# Altium schematic sheet ARDUINO_UNO_CH340.SchDoc
size 431 x 279 mm; SheetNumber: 1; SheetTotal: 1
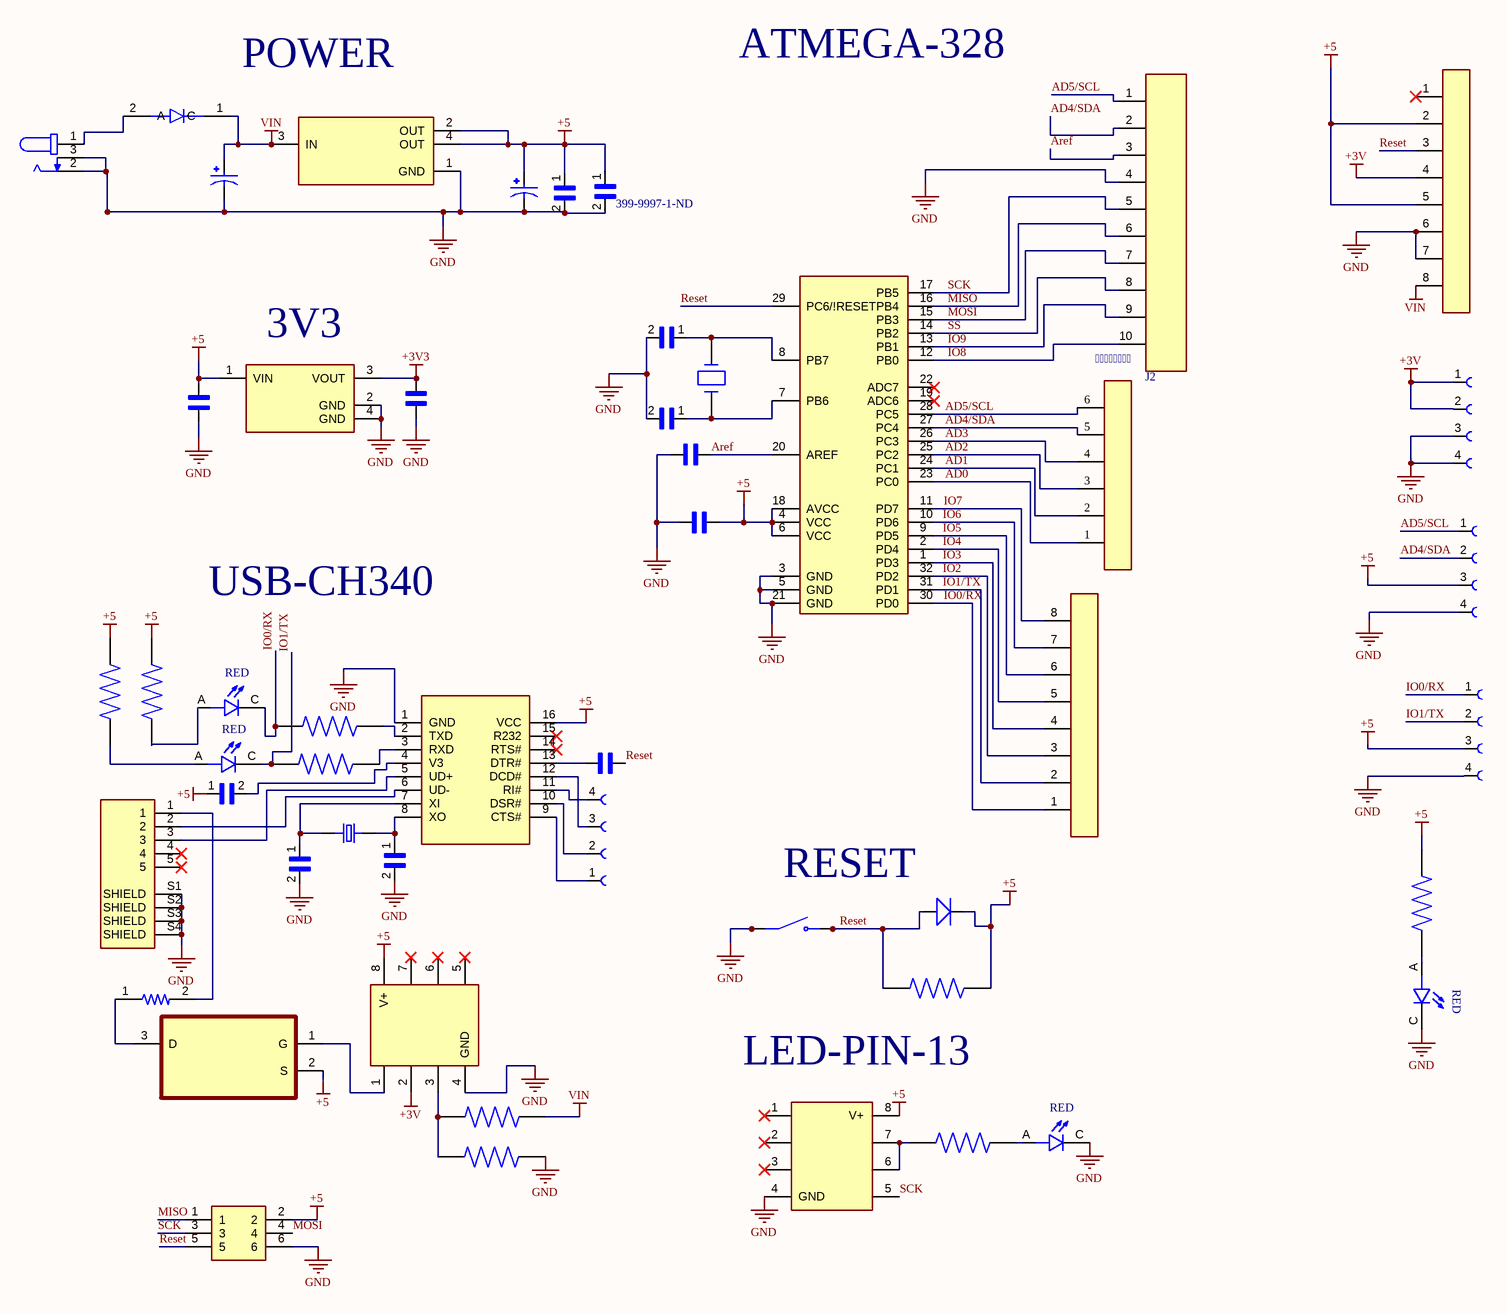
[diagram p0: ARDUINO_UNO_CH340.SchDoc]

## Parts
C1  CAP ALUM 47UF 20% 25V SMD  [CAP_25SVPD47M]  (value not drawn)
C2  CAP ALUM 47UF 20% 25V SMD  [CAP_25SVPD47M]  (value not drawn)
C3  C0805J104K5RACTU  [CAPC2012X88N]  (value not drawn)
C4  Supplier Part Number 1: 399-9997-1-ND  [CAPC2012X88N]  (hidden comment: C0805J104K5RACTU)
C5  CAP CER 25PF 100V NP0 0805  [CAPC2012X94N]  (value not drawn)
C6  CAP CER 25PF 100V NP0 0805  [CAPC2012X94N]  (value not drawn)
C7  885012209041  [WCAP-CSGP_885012209041]  (value not drawn)
C8  885012209041  [WCAP-CSGP_885012209041]  (value not drawn)
C9  885012209041  [WCAP-CSGP_885012209041]  (value not drawn)
C10  885012209041  [WCAP-CSGP_885012209041]  (value not drawn)
C11  CAP CER 0805 10NF 50V C0G 1%  [CAPC2012X88N]  (value not drawn)
C12  885012209041  [WCAP-CSGP_885012209041]  (value not drawn)
C13  CAP CER 25PF 100V NP0 0805  [CAPC2012X94N]  (value not drawn)
C14  CAP CER 25PF 100V NP0 0805  [CAPC2012X94N]  (value not drawn)
CO1  CRYSTAL 16.0000MHZ 18PF SMD  [XTAL_ABLS2-24.000MHZ-D4YF-T]  (value not drawn)
CP1  CONN PWR JACK 2X5.5MM SOLDER  [POWERJACK_CUI_PJ-002A]  (value not drawn)
D1  S1M-FDITR-ND  [DIODE_DIOM4226X244N]  (value not drawn)
D2  7012X1  [LED_7012X1]  (value not drawn)
D3  7012X1  [LED_7012X1]  (value not drawn)
D4  DIODE GEN PURP 100V 150MA 1206  [DIODE]  (value not drawn)
D5  7012X1  [LED_7012X1]  (value not drawn)
D6  7012X1  [LED_7012X1]  (value not drawn)
J1  Conn_Sullins_PPTC081LFBN-RC_eec  [Sullins_PPTC081LFBN-RC_0]  (value not drawn)
J2  Conn_Sullins_PPTC101LFBN-RC_eec  [Sullins_PPTC101LFBN-RC_0 - duplicate2]  (value not drawn)
J3  PPTC061LFBN-RC  [Sullins_PPTC061LFBN-RC_0]  (value not drawn)
J4  Conn_Sullins_PPTC081LFBN-RC_eec  [Sullins_PPTC081LFBN-RC_0]  (value not drawn)
J5  1734035-4  [J_SMD_1734035-4-5_0.8_9.9_8.85_3.9]  (value not drawn)
J6  67997-206HLF  [FRAMATOME_67997-206HLF]  (value not drawn)
K1  61300411121  [61300411121]  (value not drawn)
K2  61300411121  [61300411121]  (value not drawn)
K3  61300411121  [61300411121]  (value not drawn)
K4  61300411121  [61300411121]  (value not drawn)
MC1  ATMEGA328P-AU  [QFP80P900X900X120-32N]  (value not drawn)
R1  1kOhm,0805,1%,50ppm, 100mW,100VRN732ATTDK1001F50  [RESC2012X60N]  (value not drawn)
R2  1kOhm,0805,1%,50ppm, 100mW,100VRN732ATTDK1001F50  [RESC2012X60N]  (value not drawn)
R3  1kOhm,0805,1%,50ppm, 100mW,100VRN732ATTDK1001F50  [RESC2012X60N]  (value not drawn)
R4  1kOhm,0805,1%,50ppm, 100mW,100VRN732ATTDK1001F50  [RESC2012X60N]  (value not drawn)
R5  1kOhm,0805,1%,50ppm, 100mW,100VRN732ATTDK1001F50  [RESC2012X60N]  (value not drawn)
R6  1kOhm,0805,1%,50ppm, 100mW,100VRN732ATTDK1001F50  [RESC2012X60N]  (value not drawn)
R7  PICOSMDC050S-2  [RESC2012X60N]  (value not drawn)
R8  CRGCQ0805F10K  [RESC2012X65N]  (value not drawn)
R9  CRGCQ0805F10K  [RESC2012X65N]  (value not drawn)
R10  1kOhm,0805,1%,50ppm, 100mW,100VRN732ATTDK1001F50  [RESC2012X60N]  (value not drawn)
S1  2-1437565-8  [SW_2-1437565-8]  (value not drawn)
U1  NCP1117ST50T3G  [SOT230P700X180-4N]  (value not drawn)
U2  MCP1703T-3302E/DB  [SOT230P700X180-4N - duplicate]  (value not drawn)
U3  CH340 USB 2.0 to UART Interface Evaluation Board  [SO16]  (value not drawn)
U4  LM358M/NOPB  [SOIC127P599X175-8N]  (value not drawn)
U5  SI2301BDS-T1-E3  [SOT95P237X112-3N]  (value not drawn)
U6  LM358M/NOPB  [SOIC127P599X175-8N]  (value not drawn)
Y1  ECS-120-S-5PX-TR  [XTAL_ECS-120-S-5PX-TR]  (value not drawn)

## Nets
+3V: J1.4 K1.1 K1.2 U4.2(-INA)
+3V3: C7.2 U2.3(VOUT)
+5: C2.1 C3.1 C4.1 C8.2 C10.1 C11.1 D4.NEG J1.2 J1.5 J6.2 K2.3 K3.3 MC1.4(VCC) MC1.6(VCC) MC1.18(AVCC) R1.2 R2.1 R5.1 R6.2 U1.2(OUT) U1.4(OUT) U2.1(VIN) U3.16(VCC) U4.8(V+) U5.2(S) U6.8(V+)
GND: C1.2 C2.2 C3.2 C4.2 C5.2 C6.2 C7.1 C8.1 C9.1 C10.2 C13.2 C14.2 CP1.2 CP1.3 D5.C D6.C J1.6 J1.7 J2.4 J5.S1(SHIELD) J5.S2(SHIELD) J5.S3(SHIELD) J5.S4(SHIELD) J6.6 K1.3 K1.4 K2.4 K3.4 MC1.3(GND) MC1.5(GND) MC1.21(GND) R9.2 S1.1(COM) S1.2(COM) U1.1(GND) U2.2(GND) U2.4(GND) U3.1(GND) U4.4(GND) U6.4(GND)
VIN: C1.1 D1.1(C) J1.8 R8.2 U1.3(IN)
AD0: J3.1 MC1.23(PC0)
AD1: J3.2 MC1.24(PC1)
AD2: J3.3 MC1.25(PC2)
AD3: J3.4 MC1.26(PC3)
AD4/SDA: J2.2 J3.5 K2.2 MC1.27(PC4)
AD5/SCL: J2.1 J3.6 K2.1 MC1.28(PC5)
Aref: C9.2 J2.3 MC1.20(AREF)
IO0/RX: D2.C J4.1 K3.1 MC1.30(PD0) R3.1
IO1/TX: D3.C J4.2 K3.2 MC1.31(PD1) R4.1
IO2: J4.3 MC1.32(PD2)
IO3: J4.4 MC1.1(PD3)
IO4: J4.5 MC1.2(PD4)
IO5: J4.6 MC1.9(PD5)
IO6: J4.7 MC1.10(PD6)
IO7: J4.8 MC1.11(PD7)
IO8: J2.10 MC1.12(PB0)
IO9: J2.9 MC1.13(PB1)
MISO: J2.6 J6.1 MC1.16(PB4)
MOSI: J2.7 J6.4 MC1.15(PB3)
Reset: C12.1 D4.POS J1.3 J6.5 MC1.29(PC6/!RESET) R6.1 S1.3(NO) S1.4(NO)
SCK: J2.5 J6.3 MC1.17(PB5) U6.5(+INB)
SS: J2.8 MC1.14(PB2)
NetC5_1: C5.1 CO1.1 MC1.8(PB7)
NetC6_1: C6.1 CO1.2 MC1.7(PB6)
NetC11_2: C11.2 U3.4(V3)
NetC12_2: C12.2 U3.13(DTR#)
NetC13_1: C13.1 U3.8(XO) Y1.2
NetC14_1: C14.1 U3.7(XI) Y1.1
NetCP1_1: CP1.1 D1.2(A)
NetD2_A: D2.A R2.2
NetD3_A: D3.A R1.1
NetD5_A: D5.A R5.2
NetD6_A: D6.A R10.2
NetJ5_1: J5.1 R7.2
NetJ5_2: J5.2 U3.6(UD-)
NetJ5_3: J5.3 U3.5(UD+)
NetK4_1: K4.1 U3.9(CTS#)
NetK4_2: K4.2 U3.10(DSR#)
NetK4_3: K4.3 U3.12(DCD#)
NetK4_4: K4.4 U3.11(RI#)
NetR3_2: R3.2 U3.2(TXD)
NetR4_2: R4.2 U3.3(RXD)
NetR7_1: R7.1 U5.3(D)
NetR8_1: R8.1 R9.1 U4.3(+INA)
NetR10_1: R10.1 U6.6(-INB) U6.7(OUTB)
NetU4_1: U4.1(OUTA) U5.1(G)

Not connected (* = marked no-connect by the designer): J1 1*; J5 4* 5*; MC1 19(ADC6)* 22(ADC7)*; U3 14(RTS#)* 15(R232)*; U4 5(+INB)* 6(-INB)* 7(OUTB)*; U6 1(OUTA)* 2(-INA)* 3(+INA)*

## Notes on the sheet
- POWER
- ATMEGA-328
- (near U2) 3V3
- USB-CH340
- RESET
- LED-PIN-13
- DWG. NO.
- REV.
- SHT.
- THIS DOCUMENT AND THE DATA DISCLOSED HEREIN OR HEREWITH IS THE PROPERTY OF ALTIUM LIMITED AND MAY BE FREELY DISTRIBUTED IN WHOLE. NO RIGHTS ARE RESERVED OR EXPRESS OR IMPLIED WARANTEE GIVEN.
- REVISION
- DESCRIPTION
- DATE
- APPROVED
- ENG:
- APPROVALS
- PROJECT
- DSN:
- CHK:
- REFERENCE DOCUMENTS
- PROJECT REVISION:
- TITLE
- DOCUMENT REVISION:
- DESIGN ITEM:
- BOM:
- FAB DWG:
- PCB DWG:
- ASSY DWG:
- SCALE:
- SIZE
- B
- CAGE CODE
- FILE NAME
- DWG NO.
- SHEET
- OF
- REV
- (in symbol 7012X1) RED
- (in symbol LM358M/NOPB) B; A

## Library data of the parts
C1 C2 = 25SVPD47M: 47 µF 25 V Aluminum Electrolytic Capacitors Radial, Can - SMD - 3000 Hrs @ 105°C; Package: None; Availability: Unavailable; Value: *; MP: 25SVPD47M; Price: None; Supplier 1: Newark; Supplier Part Number 1: 31T8177
C3 C4 = C0805J104K5RACTU: CAP MLCC, 0.1UF, 50V, X7R, 10%, 0805; Product Range: KEMET - J Series; Capacitance; SnapEDA_Link: https://www.snapeda.com/parts/C0805J104K5RACTU/KEMET/view-part/1757688/?ref=snap; MF: KEMET; Mouser-Purchase-URL: https://snapeda.com/shop?store=Mouser&id=1757688; Availability: Warning; Value: *; Package: 0805 KEMET; MP: C0805J104K5RACTU; Price: None; Supplier 1: Digi-Key
  C3: Supplier Part Number 1: 399-9997-1-ND
C5 C6 C13 C14 = 08051A250GAT2A: 25 pF ±2% 100V Ceramic Capacitor C0G, NP0 0805 (2012 Metric); Package: None; Price: None; Value: *; MP: 08051A250GAT2A; Availability: Unavailable; Supplier 1: Digi-Key; Supplier Part Number 1: 08051A250GAT2A-ND
C7-C10 C12 = 885012209041: WCAP-CSGP General Purpose MLCC; SMT 1210; X7R; 100nF 10%; 50V; -55C to +125C; Tech. PN X7R1210104K050DFCT1000; Package: None; Price: None; Value: *; MP: 885012209041; Availability: Unavailable
C11 = C0805C103F5GEC-ND: ±1% 50V Ceramic Capacitor C0G, NP0 0805 (2012 Metric); MF: KEMET; MP: C0805J104K5RACTU; SnapEDA_Link: https://www.snapeda.com/parts/C0805J104K5RACTU/KEMET/view-part/1757688/?ref=snap; Mouser-Purchase-URL: https://snapeda.com/shop?store=Mouser&id=1757688; Availability: Warning; Value: *; Package: 0805 KEMET; Price: None; Supplier 1: Digi-Key; Supplier Part Number 1: C0805C103F5GEC-ND
CO1 = ABLS2-24.000MHZ-D4YF-T: 24MHz Â±30ppm Crystal 18pF 40 Ohms HC-49/US; MF: Abracon; Value: *; MP: ABLS2-24.000MHZ-D4YF-T; Availability: Good; SnapEDA_Link: https://www.snapeda.com/parts/ABLS2-24.000MHZ-D4YF-T/Abracon%20LLC/view-part/412221/?ref=snap; Purchase-URL: https://pricing.snapeda.com/search/part/ABLS2-24.000MHZ-D4YF-T/?ref=eda; Price: None; Check_prices: https://www.snapeda.com/parts/ABLS2-24.000MHZ-D4YF-T/Abracon%20LLC/view-part/412221/?ref=eda; Package: HC49/US Abracon; Supplier 1: Digi-Key; Supplier Part Number 1: 535-10212-1-ND
CP1 = CP-002A-ND: Power Barrel Connector Jack 2.10mm ID (0.083"), 5.50mm OD (0.217") Through Hole, Right Angle; Supplier 1: Onlinecomponents.com; Supplier Part Number 1: PJ-002AH-SMT-TR
D1 = DIODE_S1G: DIODE GEN PURP 1KV 1A SMA; MF: ON Semiconductor; MP: ES1G; Package: DO-214AC-214 ON Semiconductor; Value: *; Price: None; Availability: Unavailable; SnapEDA_Link: https://www.snapeda.com/parts/ES1G/ON%20Semiconductor/view-part/1427700/?ref=snap; Supplier 1: Digi-Key; Supplier Part Number 1: S1M-FDICT-ND
D2 D3 D5 D6 = 7012X1: Red LED Indication - Discrete 1.7V 0805 (2012 Metric); Package: None; Price: None; Value: *; MP: 7012X1; Availability: Unavailable; Supplier 1: Digi-Key; Supplier Part Number 1: 732-4984-1-ND
D4 = CD1206-S01575: Diode Standard 100V 150mA Surface Mount 1206; MF: Bourns; Price: None; Availability: Unavailable; Package: 1206 Bourns; MP: CD1206-S01575; Value: *; SnapEDA_Link: https://www.snapeda.com/parts/CD1206-S01575/Bourns%20-%20J.W.%20Miller/view-part/42622/?ref=snap; Supplier 1: Avnet; Supplier Part Number 1: CD1206-S01575
J1 J4 = Conn_Sullins_PPTC081LFBN-RC_eec: CONN HEADER FEMALE 8POS .1" TIN; Is Female: yes; helpURL: https://upverter.com/upn/revision/35dac8b21b21bbc7/; ComponentLink2Description: Datasheet; Temperature: -40°C to +105°C; Package: HDR8; Supplier 2: Mouser; Price: 0.506645376634; Supplier 1: Digi-Key; ComponentLink1URL: https://upverter.com/upn/revision/35dac8b21b21bbc7/; Supplier Part Number 1: S7006-ND; Manufacturer: Sullins; ComponentLink1Description: Upverter; ComponentLink2URL: http://www.sullinscorp.com/drawings/78_P(N)PxCxxxLFBN-RC,_10492-H.pdf; RoHS: TRUE; Temperature Range High: +105°C; Digikey Description: CONN HEADER FEMALE 8POS .1" TIN; Digikey Part Number: S7006-ND; Lead Free: yes; Temperature Range Low: -40°C; Part Number: PPTC081LFBN-RC
J2 = Conn_Sullins_PPTC101LFBN-RC_eec: CONN HEADER FEMALE 10POS.1" TIN; Category Bda670Ac885E6661: Uncategorized; Category E7012A0Bd22E3Cc6: Headers & Receptacles; contact_material: Phosphor Bronze; pin_pitch: 2.54 mm; Is Female: yes; number_of_rows: 1; Category 75Fab8F04590Ae3D: Connectors and Adapters; number_of_positions: 10; Symbol 0 0: Standard; Category 0836C53C3D42D3F1: Connectors; helpURL: https://upverter.com/upn/revision/438243a39a4aeeed/; ComponentLink2Description: Datasheet; Temperature: -40°C to +105°C; Package: HDR10; Supplier 2: Mouser; Price: 0.506714616829; Supplier 1: Digi-Key; ComponentLink1URL: https://upverter.com/upn/revision/438243a39a4aeeed/; Supplier Part Number 1: S7008-ND; Manufacturer: Sullins; ComponentLink1Description: Upverter; ComponentLink2URL: http://www.sullinscorp.com/drawings/78_P(N)PxCxxxLFBN-RC,_10492-H.pdf; RoHS: TRUE; Temperature Range High: +105°C; Octopart Part Number: a3ed6ae3a4397c2a; Digikey Description: CONN HEADER FEMALE 10POS.1" TIN; Digikey Part Number: S7008-ND; Category A3C16Ecb93907806: Uncategorized; Type: integrated circuit; Lead Free: yes; Temperature Range Low: -40°C; Mounting Type: through hole; Num Pins: 10; housing_material: Plastic; Part Number: PPTC101LFBN-RC
J5 = 1734035-4: Conn Mini USB 2.0 Type B RCP 5 POS 0.8mm Solder RA SMD 5 Terminal 1 Port Automotive T/R; MF: TE Connectivity; Centerline_Pitch: .8 mm[.031 in]; Product_Type: Connector; Number_of_Positions: 5; Digi-Key_Purchase_URL: https://www.digikey.com/product-detail/en/te-connectivity-amp-connectors/1734035-4/A121554CT-ND/5246531?utm_source=snapeda&utm_medium=aggregator&utm_campaign=symbol; TE_purchase_URL: https://www.te.com/usa-en/product-1734035-4.html?te_bu=Cor&te_type=disp&te_campaign=seda_glo_cor-seda-global-disp-prtnr-fy19-seda-model-bom-cta_sma-317_1&elqCampaignId=32493; Value: *; Digi-Key_Part_Number: A121554CT-ND; SnapEDA_Link: https://www.snapeda.com/parts/1734035-4/TE%20Connectivity%20AMP%20Connectors/view-part/422958/?ref=snap; EU_RoHS_Compliance: Compliant; MP: 1734035-4; Package: None
J6 = 67997-206HLF: Connector Header Through Hole 6 position 0.100 _2.54mm_; MF: Amphenol ICC; SnapEDA_Link: https://www.snapeda.com/parts/67997-206HLF/Amphenol%20FCI/view-part/103429/?ref=snap; Value: *; Digi-Key_Purchase_URL: https://www.digikey.com/product-detail/en/amphenol-icc-fci/67997-206HLF/609-3234-ND/1878491?utm_source=snapeda&utm_medium=aggregator&utm_campaign=symbol; Digi-Key_Part_Number: 609-3234-ND; MP: 67997-206HLF; Package: None
K1-K4 = 61300411121: Connector Header Through Hole 4 position 0.100 (2.54mm); MF: WÃ¼rth Elektronik; Price: None; Check_prices: https://www.snapeda.com/parts/61300411121/W%C3%BCrth%20Elektronik/view-part/4802916/?ref=eda; SnapEDA_Link: https://www.snapeda.com/parts/61300411121/W%C3%BCrth%20Elektronik/view-part/4802916/?ref=snap; Package: None; Availability: In Stock; MP: 61300411121; Value: *
MC1 = ATMEGA328P-AU: AVR AVRÂ® ATmega Microcontroller IC 8-Bit 20MHz 32KB _16K x 16_ FLASH 32-TQFP _7x7_; MF: Microchip; Value: *; SnapEDA_Link: https://www.snapeda.com/parts/ATMEGA328P-AU/Microchip/view-part/44280/?ref=snap; MP: ATMEGA328P-AU; Availability: Unavailable; Price: None; Package: TQFP-32 Microchip; Supplier 1: RSComponents; Supplier Part Number 1: 1310271
R1-R6 R10 = 1kOhm,0805,1%,50ppm, 100mW,100VRN732ATTDK1001F50: Thin Film Resistors - SMD 1kOhm,0805,1%,50ppm, 100mW,100V; Package: None; Price: None; Value: *; MP: RN732ATTDK1001F50; Availability: Unavailable; Supplier 1: Future Electronics; Supplier Part Number 1: 7028531
R7 = PICOSMDC050S-2: Polymeric PTC Resettable Fuse 6V 500mA Ih Surface Mount 0805 _2012 Metric_, Concave; MF: Littelfuse Inc.; Price: None; SnapEDA_Link: https://www.snapeda.com/parts/PICOSMDC050S-2/Littelfuse%20Inc./view-part/1315044/?ref=snap; MP: PICOSMDC050S-2; Value: *; Availability: Unavailable; Package: 0805 TE Connectivity; Supplier 1: Digi-Key; Supplier Part Number 1: PICOSMDC050S-2CT-ND
R8 R9 = CRGCQ0805F10K: Fixed Resistor CRGCQ 0805 10K 1%; MF: TE Connectivity; MP: CRGCQ0805F10K; DigiKey-Purchase-URL: https://snapeda.com/shop?store=DigiKey&id=3188209; Arrow_Electronics-Purchase-URL: https://snapeda.com/shop?store=Arrow+Electronics&id=3188209; Availability: Unavailable; SnapEDA_Link: https://www.snapeda.com/parts/CRGCQ0805F10K/TE%20Connectivity/view-part/3188209/?ref=snap; Package: 2012 TE Connectivity; Price: None; Value: *; Supplier 1: Digi-Key; Supplier Part Number 1: A129761CT-ND
S1 = 2-1437565-8: Tactile Switch SPST-NO Top Actuated Surface Mount; MF: TE Connectivity; Configuration_Pole-Throw: Single Pole - Single Throw; Contact_Current_Rating: 50 mA; SnapEDA_Link: https://www.snapeda.com/parts/2-1437565-8/TE%20Connectivity%20ALCOSWITCH%20Switches/view-part/455292/?ref=snap; Availability: Unavailable; TE_purchase_URL: https://www.te.com/usa-en/product-2-1437565-8.html?te_bu=Cor&te_type=disp&te_campaign=seda_glo_cor-seda-global-disp-prtnr-fy19-seda-model-bom-cta_sma-317_1&elqCampaignId=32493; Value: *; Price: None; MP: 2-1437565-8; Package: None; Supplier 1: Digi-Key; Supplier Part Number 1: 450-3355-ND
U1 = NCP1117ST50T3G: Linear Voltage Regulator IC 1 Output 1A SOT-223; MF: ON Semiconductor; MP: NCP1117ST50T3G; Package: TO-261-4 ON Semiconductor; Price: None; Value: *; SnapEDA_Link: https://www.snapeda.com/parts/NCP1117ST50T3G/ON%20Semiconductor/view-part/836318/?ref=snap; Availability: Unavailable; Supplier 1: Newark; Supplier Part Number 1: 71J6563
U2 = MCP1703T-3302E/DB: Linear Voltage Regulator IC 1 Output 250mA SOT-223-3; MF: Microchip; MP: MCP1703T-3302E/DB; Availability: Unavailable; SnapEDA_Link: https://www.snapeda.com/parts/MCP1703T-3302E/DB/Microchip/view-part/1037153/?ref=snap; Value: *; Package: SOT-223-3 Microchip; Price: None
U3 = CH340: MF: DFRobot; Value: *; Price: None; Package: None; SnapEDA_Link: https://www.snapeda.com/parts/CH340/DFRobot/view-part/53354/?ref=snap; Availability: Unavailable; MP: CH340; Supplier 1: Onlinecomponents.com; Supplier Part Number 1: 317990026
U4 U6 = LM358M/NOPB: 2-Channel, 1MHz, industry standard, 32V op amp 8-SOIC 0 to 70; MF: Texas Instruments; MP: LM358M; Digi-Key_Part_Number: LM358MX/NOPBTR-ND; SnapEDA_Link: https://www.snapeda.com/parts/LM358M/Texas%20Instruments/view-part/4800527/?ref=snap; Package: SOIC-8 Texas Instruments; DigiKey-Purchase-URL: https://snapeda.com/shop?store=DigiKey&id=4800527; Value: *; Check_prices: https://www.snapeda.com/parts/LM358M/Texas%20Instruments/view-part/4800527/?ref=eda
U5 = SI2301BDS-T1-E3: P-Channel 20V 2.2A _Ta_ 700mW _Ta_ Surface Mount SOT-23-3 _TO-236_; MF: Vishay; Package: SOT-23-3 Vishay; MP: SI2301BDS-T1-E3; SnapEDA_Link: https://www.snapeda.com/parts/SI2301BDS-T1-E3/Vishay%20Siliconix/view-part/277675/?ref=snap; Value: *; Availability: Unavailable; Price: None
Y1 = ECS-120-S-5PX-TR: 12MHz Â±30ppm Crystal Series 50 Ohms HC-49/US; MF: ECS Inc.; DigiKey-Purchase-URL: https://snapeda.com/shop?store=DigiKey&id=2458096; Mouser-Purchase-URL: https://snapeda.com/shop?store=Mouser&id=2458096; Value: *; Availability: Unavailable; Arrow_Electronics-Purchase-URL: https://snapeda.com/shop?store=Arrow+Electronics&id=2458096; Price: None; Package: HC49/US ECS International; MP: ECS-120-S-5PX-TR; SnapEDA_Link: https://www.snapeda.com/parts/ECS-120-S-5PX-TR/ECS%20Inc./view-part/2458096/?ref=snap